# Altium schematic sheet ADC.SchDoc
size Letter; Author: Adam Gilbert; CompanyName: McGill University; DrawnBy: Adam Gilbert; Organization: Altium Limited; Address1: McGill Cosmology; Address2: 3600 University Street; Address3: Montreal, Quebec; Address4: Canada; DocumentNumber: 5; Revision: Rev2; SheetNumber: 5; SheetTotal: 16; ProjectTitle: DfMux FMC Mezz; ModelNumber: MGMEZZ04; ProjectName: DfMux FMC Mezz
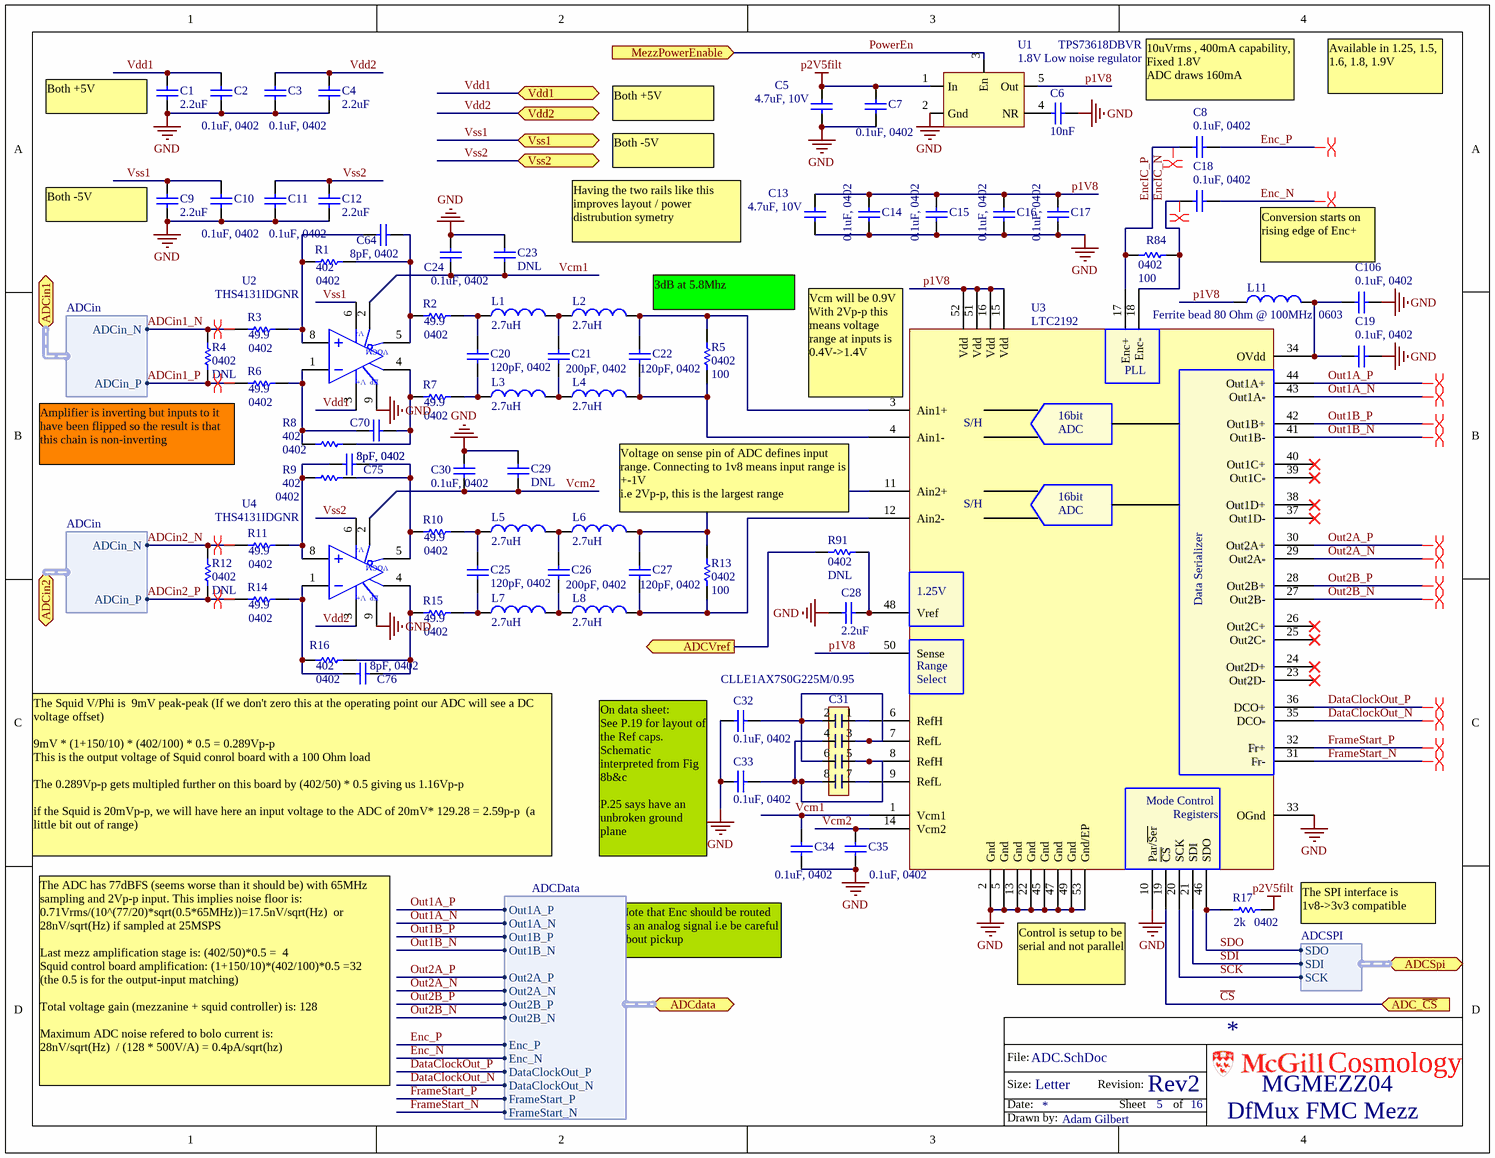
[diagram p0: ADC.SchDoc]

## Parts
C1  2.2uF  [0603]
C2  0.1uF, 0402  [0402]
C3  0.1uF, 0402  [0402]
C4  2.2uF  [0603]
C5  4.7uF, 10V  [0805]
C6  10nF  [0603]
C7  0.1uF, 0402  [0402]
C8  0.1uF, 0402  [0402]
C9  2.2uF  [0603]
C10  0.1uF, 0402  [0402]
C11  0.1uF, 0402  [0402]
C12  2.2uF  [0603]
C13  4.7uF, 10V  [0805]
C14  0.1uF, 0402  [0402]
C15  0.1uF, 0402  [0402]
C16  0.1uF, 0402  [0402]
C17  0.1uF, 0402  [0402]
C18  0.1uF, 0402  [0402]
C19  0.1uF, 0402  [0402]
C20  120pF, 0402  [0402]
C21  200pF, 0402  [0402]
C22  120pF, 0402  [0402]
C23  DNL  [0603]
C24  0.1uF, 0402  [0402]
C25  120pF, 0402  [0402]
C26  200pF, 0402  [0402]
C27  120pF, 0402  [0402]
C28  2.2uF  [0603]
C29  DNL  [0603]
C30  0.1uF, 0402  [0402]
C31  CLLE1AX7S0G225M/0.95  [CLLE1]
C32  0.1uF, 0402  [0402]
C33  0.1uF, 0402  [0402]
C34  0.1uF, 0402  [0402]
C35  0.1uF, 0402  [0402]
C64  8pF, 0402  [0402]
C70  8pF, 0402  [0402]
C75  8pF, 0402  [0402]
C76  8pF, 0402  [0402]
C106  0.1uF, 0402  [0402]
L1  2.7uH  [0603]
L2  2.7uH  [0603]
L3  2.7uH  [0603]
L4  2.7uH  [0603]
L5  2.7uH  [0603]
L6  2.7uH  [0603]
L7  2.7uH  [0603]
L8  2.7uH  [0603]
L11  Ferrite bead 80 Ohm @ 100MHz  0603  [0603]
R1  402  [0402]
R2  49.9  [0402]
R3  49.9  [0402]
R4  DNL  [0402]
R5  100  [0402]
R6  49.9  [0402]
R7  49.9  [0402]
R8  402  [0402]
R9  402  [0402]
R10  49.9  [0402]
R11  49.9  [0402]
R12  DNL  [0402]
R13  100  [0402]
R14  49.9  [0402]
R15  49.9  [0402]
R16  402  [0402]
R17  2k  [0402]
R84  100  [0402]
R91  DNL  [0402]
U1  1.8V Low noise regulator  [SOT23-5]
U2  THS4131IDGNR  [SOP8-EP-127P600-8N]
U3  LTC2192  [QFN50P800X700X80_HS-53N]
U4  THS4131IDGNR  [SOP8-EP-127P600-8N]

## Ports
ADC_~{CS} (in), ADCdata (harness ADCData), ADCin1 (harness ADCin), ADCin2 (harness ADCin), ADCSpi (harness ADCSPI), ADCVref (out), MezzPowerEnable (in), Vdd1, Vdd2, Vss1, Vss2

## Harnesses
ADCin: ADCin_P, ADCin_N
ADCSPI: SDO, SDI, SCK
ADCData: Enc_P, Enc_N, Out1A_P, Out1A_N, Out1B_P, Out1B_N, Out2A_P, Out2A_N, Out2B_P, Out2B_N, DataClockOut_P, DataClockOut_N, FrameStart_P, FrameStart_N

## Nets
GND: C1.2 C2.1 C3.1 C4.2 C5.1 C6.1 C7.1 C9.2 C10.1 C11.1 C12.2 C13.1 C14.1 C15.1 C16.1 C17.1 C19.2 C23.2 C24.1 C28.2 C29.2 C30.1 C32.1 C33.1 C34.2 C35.2 C106.2 U1.2(Gnd) U2.9(EP) U3.2(Gnd) U3.5(Gnd) U3.10(Par/~{Ser}) U3.13(Gnd) U3.22(Gnd) U3.33(OGnd) U3.45(Gnd) U3.47(Gnd) U3.49(Gnd) U3.53(Gnd/EP) U4.9(EP)
p2V5filt: C5.2 C7.2 R17.1 U1.1(In)
ADCin1_N: R3.1 R4.2 ; port ADCin1.ADCin_N
ADCin1_P: R4.1 R6.1 ; port ADCin1.ADCin_P
ADCin2_N: R11.1 R12.2 ; port ADCin2.ADCin_N
ADCin2_P: R12.1 R14.1 ; port ADCin2.ADCin_P
ADCVref: R91.2 ; port ADCVref
~{CS}: U3.19(~{CS}) ; port ADC_~{CS}
DataClockOut_N: U3.35(DCO-) ; port ADCdata.DataClockOut_N
DataClockOut_P: U3.36(DCO+) ; port ADCdata.DataClockOut_P
Enc_N: C18.2 ; port ADCdata.Enc_N
Enc_P: C8.2 ; port ADCdata.Enc_P
EncIC_N: C18.1 R84.1 U3.18(Enc-)
EncIC_P: C8.1 R84.2 U3.17(Enc+)
FrameStart_N: U3.31(Fr-) ; port ADCdata.FrameStart_N
FrameStart_P: U3.32(Fr+) ; port ADCdata.FrameStart_P
Out1A_N: U3.43(Out1A-) ; port ADCdata.Out1A_N
Out1A_P: U3.44(Out1A+) ; port ADCdata.Out1A_P
Out1B_N: U3.41(Out1B-) ; port ADCdata.Out1B_N
Out1B_P: U3.42(Out1B+) ; port ADCdata.Out1B_P
Out2A_N: U3.29(Out2A-) ; port ADCdata.Out2A_N
Out2A_P: U3.30(Out2A+) ; port ADCdata.Out2A_P
Out2B_N: U3.27(Out2B-) ; port ADCdata.Out2B_N
Out2B_P: U3.28(Out2B+) ; port ADCdata.Out2B_P
p1V8: C13.2 C14.2 C15.2 C16.2 C17.2 L11.1 U1.5(Out) U3.15(Vdd) U3.16(Vdd) U3.50(Sense) U3.51(Vdd) U3.52(Vdd)
PowerEn: U1.3(En) ; port MezzPowerEnable
SCK: U3.20(SCK) ; port ADCSpi.SCK
SDI: U3.21(SDI) ; port ADCSpi.SDI
SDO: R17.2 U3.46(SDO) ; port ADCSpi.SDO
Vcm1: C23.1 C24.2 C34.1 U2.2(VOCM) U3.1(Vcm1)
Vcm2: C29.1 C30.2 C35.1 U3.14(Vcm2) U4.2(VOCM)
Vdd1: C1.1 C2.2 U2.3(V+) ; port Vdd1
Vdd2: C3.2 C4.1 U4.3(V+) ; port Vdd2
Vss1: C9.1 C10.2 U2.6(V-) ; port Vss1
Vss2: C11.2 C12.1 U4.6(V-) ; port Vss2
NetC6_2: C6.2 U1.4(NR)
NetC19_1: C19.1 C106.1 L11.2 U3.34(OVdd)
NetC20_1: C20.1 L3.1 R7.2
NetC20_2: C20.2 L1.1 R2.2
NetC21_1: C21.1 L3.2 L4.1
NetC21_2: C21.2 L1.2 L2.1
NetC22_1: C22.1 L4.2 R5.1 U3.4(Ain1-)
NetC22_2: C22.2 L2.2 R5.2 U3.3(Ain1+)
NetC25_1: C25.1 L7.1 R15.2
NetC25_2: C25.2 L5.1 R10.2
NetC26_1: C26.1 L7.2 L8.1
NetC26_2: C26.2 L5.2 L6.1
NetC27_1: C27.1 L8.2 R13.1 U3.12(Ain2-)
NetC27_2: C27.2 L6.2 R13.2 U3.11(Ain2+)
NetC28_1: C28.1 R91.1 U3.48(Vref)
NetC31_1: C31.1 U3.6(RefH)
NetC31_2: C31.2 C31.3 C31.6 C32.2 U3.7(RefL)
NetC31_4: C31.4 C31.5 C31.8 C33.2 U3.8(RefH)
NetC31_7: C31.7 U3.9(RefL)
NetC64_1: C64.1 R1.2 R2.1 U2.5(OUT-)
NetC64_2: C64.2 R1.1 R3.2 U2.8(IN+)
NetC70_1: C70.1 R7.1 R8.2 U2.4(OUT+)
NetC70_2: C70.2 R6.2 R8.1 U2.1(IN-)
NetC75_1: C75.1 R9.2 R10.1 U4.5(OUT-)
NetC75_2: C75.2 R9.1 R11.2 U4.8(IN+)
NetC76_1: C76.1 R15.1 R16.2 U4.4(OUT+)
NetC76_2: C76.2 R14.2 R16.1 U4.1(IN-)

Not connected (* = marked no-connect by the designer): U2 7(NC); U3 23(Out2D-)* 24(Out2D+)* 25(Out2C-)* 26(Out2C+)* 37(Out1D-)* 38(Out1D+)* 39(Out1C-)* 40(Out1C+)*; U4 7(NC)

## Layout directives
differential pair: ADCin1_N, ADCin1_P, ADCin2_N, ADCin2_P, DataClockOut_N, DataClockOut_P, Enc_N, Enc_P, EncIC_N, EncIC_P, FrameStart_N, FrameStart_P, Out1A_N, Out1A_P, Out1B_N, Out1B_P, Out2A_N, Out2A_P, Out2B_N, Out2B_P

## Notes on the sheet
- (near C8) 10uVrms , 400mA capability, Fixed 1.8V
  ADC draws 160mA
- Available in 1.25, 1.5, 1.6, 1.8, 1.9V
- (near C1) Both +5V
- Both +5V
- Both -5V
- (near C9) Both -5V
- Having the two rails like this improves layout / power distrubution symetry
- Conversion starts on rising edge of Enc+
- 3dB at 5.8Mhz
- (near U3) Vcm will be 0.9V
  With 2Vp-p this means voltage range at inputs is 0.4V->1.4V
- Amplifier is inverting but inputs to it have been flipped so the result is that this chain is non-inverting
- (near L6) Voltage on sense pin of ADC defines input range. Connecting to 1v8 means input range is +-1V
  i.e 2Vp-p, this is the largest range
- The Squid V/Phi is  9mV peak-peak (If we don't zero this at the operating point our ADC will see a DC voltage offset)
  9mV * (1+150/10) * (402/100) * 0.5 = 0.289Vp-p
  This is the output voltage of Squid conrol board with a 100 Ohm load
  The 0.289Vp-p gets multipled further on this board by (402/50) * 0.5 giving us 1.16Vp-p
  if the Squid is 20mVp-p, we will have here an input voltage to the ADC of 20mV* 129.28 = 2.59p-p  (a little bit out of range)
- On data sheet:
  See P.19 for layout of the Ref caps. Schematic interpreted from Fig 8b&c
  P.25 says have an unbroken ground plane
- (near C34) Note that Enc should be routed as an analog signal i.e be careful about pickup
- The SPI interface is 1v8->3v3 compatible
- Control is setup to be serial and not parallel
- The ADC has 77dBFS (seems worse than it should be) with 65MHz sampling and 2Vp-p input. This implies noise floor is: 0.71Vrms/(10^(77/20)*sqrt(0.5*65MHz))=17.5nV/sqrt(Hz)  or 28nV/sqrt(Hz) if sampled at 25MSPS
  Last mezz amplification stage is: (402/50)*0.5 =  4
  Squid control board amplification: (1+150/10)*(402/100)*0.5 =32
  (the 0.5 is for the output-input matching)
  Total voltage gain (mezzanine + squid controller) is: 128
  Maximum ADC noise refered to bolo current is:
  28nV/sqrt(Hz)  / (128 * 500V/A) = 0.4pA/sqrt(hz)
- File:
- Size:
- Date:
- Letter
- Revision:
- Sheet
- of
- Cosmology
- Drawn by:
- (in symbol LTC2192) PLL; 16bit; S/H; ADC; 1.25V; Data Serializer; Range; Select; Mode Control; Registers

## Library data of the parts
C1 C4 C9 C12 C23 C28 C29 = CAP 0603: Capacitor, Ceramic, 0603; Part Constraints: 10% 6.3V X5R 0603; Manufacturer: TDK Corporation; Manufacturer Part Number 1: C1608X5R0J225K080AB; Assembly Comments: none; Temperature Coefficient: X5R; Supplier 1: Digi-Key; Supplier Part Number 1: 445-5175-1-ND; Operating Temperature: -55°C ~ 85°C; Thickness (Max): 0.037" (0.95mm); Packaging: Cut Tape (CT)
  C1 C4 C9 C12 C28: Value: 2.2uF
  C23 C29: Value: DNL
C2 C3 C7 C8 C10 C11 C14-C19 C24 C30 C32-C35 C106 = CAP 0603: Capacitor, Ceramic, 0402; Part Constraints: 10% 10V X5R 0402; Manufacturer: TDK Corporation; Manufacturer Part Number 1: C1005X5R1A104K050BA; Temperature Coefficient: X5R; Assembly Comments: none; Value: 0.1uF, 0402; Supplier 1: Digi-Key; Supplier Part Number 1: 445-1265-1-ND; Operating Temperature: -55°C ~ 85°C; Thickness (Max): 0.022" (0.55mm); Packaging: Cut Tape (CT)
C5 C13 = CAP 0805: Capacitor, Ceramic, 0805; Manufacturer Part Number 1: LMK212BJ475KD-T; Manufacturer: Taiyo Yuden; Temperature Coefficient: X5R; Assembly Comments: none; Supplier 1: Digi-Key; Supplier Part Number 1: 587-1297-6-ND; Packaging: Digi-Reel®; Operating Temperature: -55°C ~ 85°C; Thickness (Max): 0.037" (0.95mm); Value: 4.7uF, 10V; Part Constraints: LMK212BJ475KD-T
C6 = CAP 0603: Capacitor, Ceramic, 0603; Part Constraints: 10% 16V X7R 0603; Manufacturer: Generic; Assembly Comments: none; Value: 10nF; Manufacturer Part Number 1: Generic
C20-C22 C25-C27 C64 C70 C75 C76 = CAP 0402: Capacitor, Ceramic, 0402; Part Constraints: 10% 16V X7R 0402; Manufacturer: Generic; Assembly Comments: none; Manufacturer Part Number 1: Generic
  C20 C22 C25 C27: Value: 120pF, 0402
  C21 C26: Value: 200pF, 0402
  C64 C70 C75 C76: Value: 8pF, 0402
C31 = CapArray0805: 2.2uFx4 4V 0805 Cap Array; Manufacturer: TDK Corporation; Temperature Coefficient: X7S; Assembly Comments: none; Supplier 1: Digi-Key; Manufacturer Part Number 1: CLLE1AX7S0G225M/0.95; Operating Temperature: -55°C ~ 125°C; Thickness (Max): 0.037" (0.95mm); Packaging: Cut Tape (CT); Supplier Part Number 1: 445-3406-1-ND; Part Constraints: CLLE1AX7S0G225M/0.95
L1-L8 = IND 0603: Inductor 0603; Manufacturer: TDK Corporation; Part Constraints: MLF1608A2R7K; Assembly Comments: none; Value: 2.7uH; Manufacturer Part Number 1: MLF1608A2R7K
L11 = IND 0603: Inductor 0603; Manufacturer: Abracon Corporation; Part Constraints: ACML-0603-800-T; Assembly Comments: none; Value: Ferrite bead 80 Ohm @ 100MHz  0603; Manufacturer Part Number 1: ACML-0603-800-T
R1-R17 R84 R91 = RES 0402: Resistor; Manufacturer: Generic; Part Constraints: 1% 1/10W 100ppm 0402; Assembly Comments: none; Manufacturer Part Number 1: Generic
  R1 R8 R9 R16: Value: 402
  R2 R3 R6 R7 R10 R11 R14 R15: Value: 49.9
  R4 R12 R91: Value: DNL
  R5 R13 R84: Value: 100
  R17: Value: 2k
U1 = TPS73618DBVR: Fixed 1.8V 10uVrms noise 400mA regulator; Manufacturer: Texas Instruments; Assembly Comments: none; Supplier 1: Digi-Key; Manufacturer Part Number 1: TPS73618DBVR; Operating Temperature: -40°C ~ 125°C; Packaging: Cut Tape (CT); Supplier Part Number 1: 296-27063-1-ND; Part Constraints: TPS73618DBVR
U2 U4 = THS4131IDGNR: IC OPAMP DIFF 225MHZ SGL 8MSOP; Manufacturer: Texas Instruments; Assembly Comments: none; Supplier 1: Digi-Key; Manufacturer Part Number 1: THS4131IDGNR; Operating Temperature: -40°C ~ 85°C; Packaging: Cut Tape (CT); Supplier Part Number 1: 296-10047-1-ND; Part Constraints: THS4131IDGNR
U3 = LTC2192: IC ADC 16BIT PAR/SRL 65MSP 52QFN; Manufacturer Part Number 1: LTC2192IUKG#PBF; Manufacturer: Linear Technology; Assembly Comments: none; Supplier 1: Digi-Key; Operating Temperature: -40°C ~ 85°C; Packaging: Tube; Supplier Part Number 1: LTC2192IUKG#PBF-ND; Part Constraints: LTC2192IUKG#PBF